# Altium project STM32F103Mini.PrjPcb
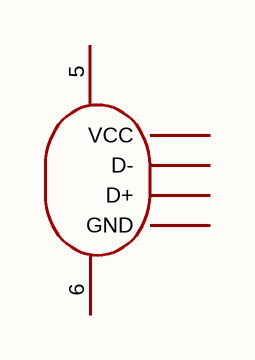
[diagram p0: STM32F103Mini.SchDoc]
1 sheet, 1 parts. Net scope: global (net labels, ports and power ports of the same name join across sheets).
Board file: STM32F103Mini-260201.PcbDoc

## Sheet STM32F103Mini.SchDoc
size A4; SheetNumber: 1; SheetTotal: 1

### Parts
CN?  USB-B-Female-90  (value not drawn)

### Nets

Not connected (* = marked no-connect by the designer): CN? 1(VCC) 2(D-) 3(D+) 4(GND) 5(SH1) 6(SH2)

### Library data of the parts
CN? = USB-B-Female-90: Symbol: USB-B-Female-90